# Altium schematic sheet Control circuit.SchDoc (part 4 of 4)
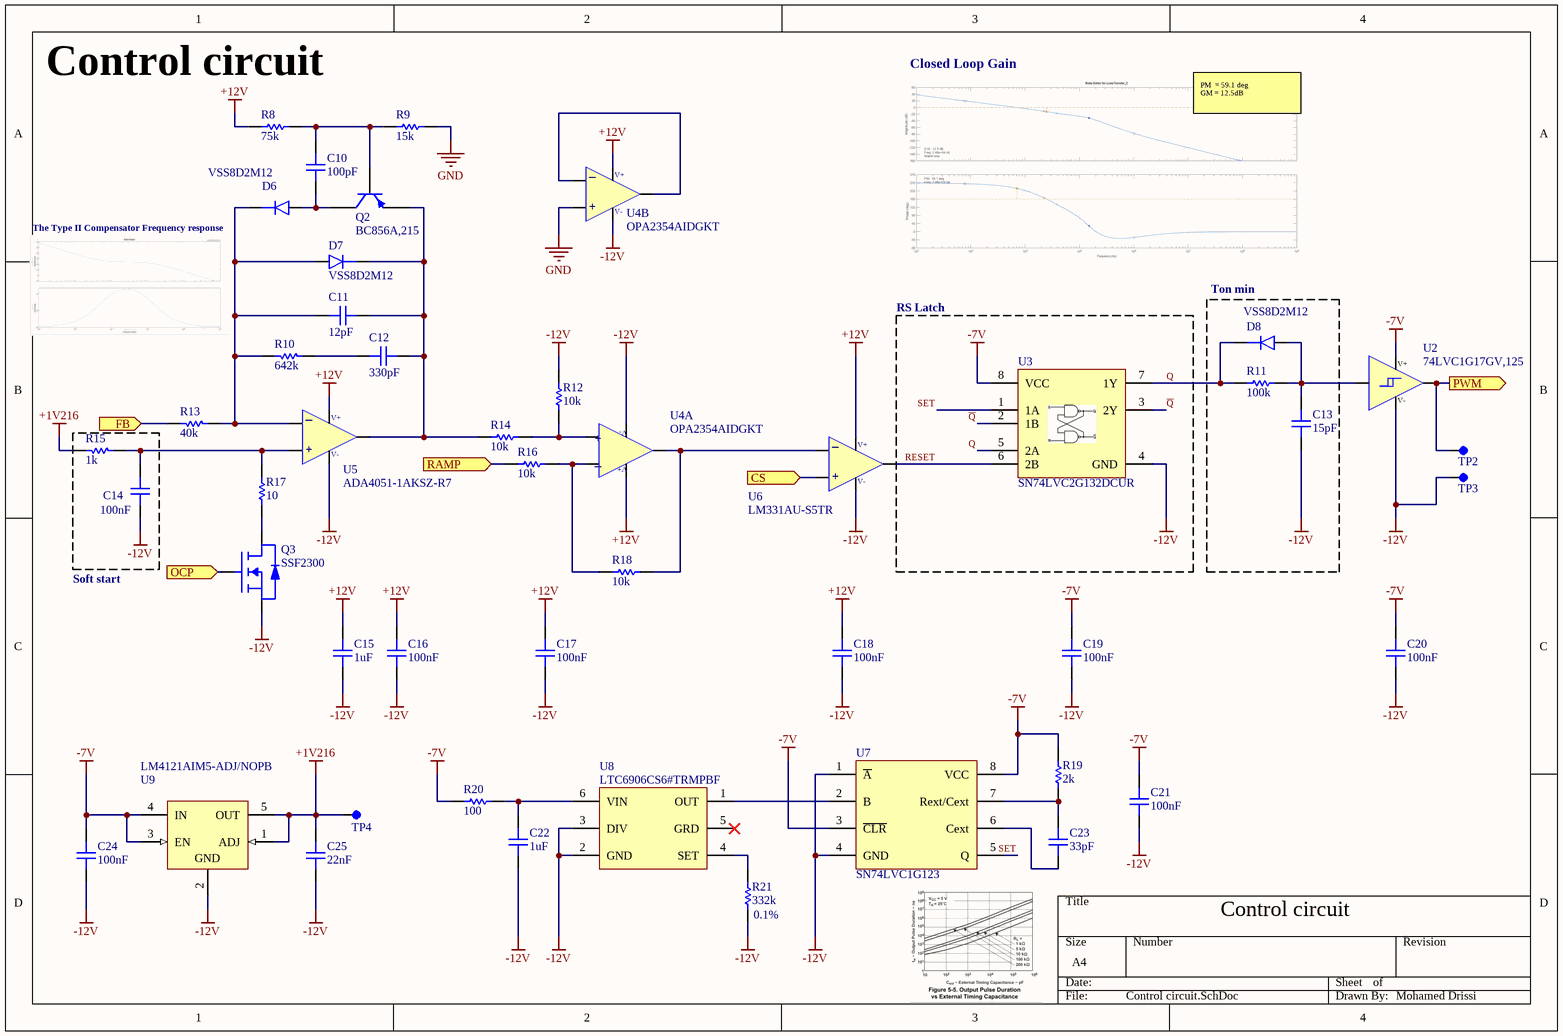
[diagram p3: Control circuit.SchDoc]

## Library data of the parts (continued)
U4 = TI OPA2354AIDGKT: 250MHz, Rail-to-Rail I/O, CMOS Dual Operational Amplifier 8-VSSOP -40 to 125; Manufacturer: Texas Instruments; Manufacturer Part Number: OPA2354AIDGKR; Manufacturer Lifecycle Status: ACTIVE; Bandwidth: 100MHz; Common Mode Rejection Ratio: 56dB; Input Bias Current: 50pA; Input Offset Voltage (Vos): 8mV; Max Dual Supply Voltage: 2.75V; Max Supply Voltage: 5.5V; Min Dual Supply Voltage: 1.25V; Min Supply Voltage: 2.7V; Number of Amplifiers: 2; Operating Supply Current: 4.9mA; Operating Supply Voltage: 5V; Output Current per Channel: 100mA; Power Supply Rejection Ratio (PSRR): 73.98dB; Settling Time: 30ns; Slew Rate: 150V/µs; Voltage Gain: 110dB; Supplier: Arrow Electronics; Supplier Part Number: OPA2354AIDGKR; RoHS: Compliant; Category: Amplifiers - Op Amps, Buffer, Instrumentation; Stock: 405; Pricing: 1=3,4072, 10=2,642, 25=2,4277, 100=2,1887, 250=2,1187 (USD); -3db Bandwidth: 250MHz; Case/Package: VSSOP; Contact Plating: Gold; Gain Bandwidth Product: 100MHz; Height: 0m; Lead Free: Lead Free; Length: 3mm; Lifecycle Status: Production; Max I/O Voltage: 8mV; Max Operating Temperature: 125°C; Min Operating Temperature: -40°C; Number of Channels: 2; Number of Circuits: 2; Number of Elements: 2; Pins: 8; Packaging: Tape & Reel; Radiation Hardening: No; REACH SVHC: No; Schedule B: 8542330000, 8542330000|8542330000|8542330000|8542330000|8542330000; Thickness: 970µm; Weight: 25.996513mg; Width: 3mm; ComponentLink1URL: https://sigma.octopart.com:443/178522223/technical_drawing/Texas-Instruments-OPA2354AIDGKR.pdf?src-supplier=Texas+Instruments; ComponentLink1Description: https://sigma.octopart.com:443/178522223/technical_drawing/Texas-Instruments-OPA2354AIDGKR.pdf?src-supplier=Texas+Instruments; ComponentLink2URL: https://octopart.com:443/opatz8j6/c1?t=Pa_9qveCSp-teMjALlNzkgIwHySsEH1otGT4-ozlPtpgDBMeQt4RGdCXYLn_JCFP1QmrjeruCX46t5_9x1Vv_HMTe8N2kMCMJSKESAMrUlSEQkUUlvcrYWij36RLFxFIZ71Lc0yaeicxHxnXPoQU53aq-yWmIh8tbbINPdenUxvDlVVEa9B7WHzU_yp1bt2IvVJEFKXj11ElcUGRh8J0UxRLcVoULThUuFLrJzUTYUNzb_hUsr_lfzCjSS3L8z7PJpNcHNUUaHBHycr75X7YKBAE5ea9dFt3yqiIqO4iZzm6zpO_8qWc6W5q5mEQ-4UQhYYz8poDoqX8BFz8V-vYXWSk_wmgHIOJwbmA8UY43GJhW0_LIaHlWEHxuqfohlnhpKt4&src-supplier=Texas+Instruments; ComponentLink2Description: https://octopart.com:443/opatz8j6/c1?t=Pa_9qveCSp-teMjALlNzkgIwHySsEH1otGT4-ozlPtpgDBMeQt4RGdCXYLn_JCFP1QmrjeruCX46t5_9x1Vv_HMTe8N2kMCMJSKESAMrUlSEQkUUlvcrYWij36RLFxFIZ71Lc0yaeicxHxnXPoQU53aq-yWmIh8tbbINPdenUxvDlVVEa9B7WHzU_yp1bt2IvVJEFKXj11ElcUGRh8J0UxRLcVoULThUuFLrJzUTYUNzb_hUsr_lfzCjSS3L8z7PJpNcHNUUaHBHycr75X7YKBAE5ea9dFt3yqiIqO4iZzm6zpO_8qWc6W5q5mEQ-4UQhYYz8poDoqX8BFz8V-vYXWSk_wmgHIOJwbmA8UY43GJhW0_LIaHlWEHxuqfohlnhpKt4&src-supplier=Texas+Instruments; ComponentLink3URL: https://datasheet.octopart.com:443/OPA2354AIDGKR-Texas-Instruments-datasheet-148930.pdf?src-supplier=Texas+Instruments; ComponentLink3Description: https://datasheet.octopart.com:443/OPA2354AIDGKR-Texas-Instruments-datasheet-148930.pdf?src-supplier=Texas+Instruments; ComponentLink4URL: https://sigma.octopart.com:443/49250154/technical_drawing/Texas-Instruments-OPA2354AIDGKR.pdf?src-supplier=Texas+Instruments; ComponentLink4Description: https://sigma.octopart.com:443/49250154/technical_drawing/Texas-Instruments-OPA2354AIDGKR.pdf?src-supplier=Texas+Instruments; ComponentLink5URL: https://datasheet.octopart.com:443/OPA2354AIDGKR-Texas-Instruments-datasheet-65713369.pdf?src-supplier=Farnell; ComponentLink5Description: https://datasheet.octopart.com:443/OPA2354AIDGKR-Texas-Instruments-datasheet-65713369.pdf?src-supplier=Farnell; ComponentLink6URL: https://datasheet.octopart.com:443/OPA2354AIDGKR-Texas-Instruments-datasheet-11534205.pdf?src-supplier=HQonline; ComponentLink6Description: https://datasheet.octopart.com:443/OPA2354AIDGKR-Texas-Instruments-datasheet-11534205.pdf?src-supplier=HQonline; ComponentLink7URL: https://datasheet.octopart.com:443/OPA2354AIDGKR-Texas-Instruments-datasheet-159115581.pdf?src-supplier=LCSC; ComponentLink7Description: https://datasheet.octopart.com:443/OPA2354AIDGKR-Texas-Instruments-datasheet-159115581.pdf?src-supplier=LCSC; ComponentLink8URL: https://datasheet.octopart.com:443/OPA2354AIDGKR.-Texas-Instruments-datasheet-33010601.pdf?src-supplier=element14+APAC; ComponentLink8Description: https://datasheet.octopart.com:443/OPA2354AIDGKR.-Texas-Instruments-datasheet-33010601.pdf?src-supplier=element14+APAC; ComponentLink9URL: https://datasheet.octopart.com:443/OPA2354AIDGKR-Texas-Instruments-datasheet-21221028.pdf?src-supplier=Newark; ComponentLink9Description: https://datasheet.octopart.com:443/OPA2354AIDGKR-Texas-Instruments-datasheet-21221028.pdf?src-supplier=Newark; ComponentLink10URL: https://datasheet.octopart.com:443/OPA2354AIDGKR-Texas-Instruments-datasheet-21222707.pdf?src-supplier=Newark; ComponentLink10Description: https://datasheet.octopart.com:443/OPA2354AIDGKR-Texas-Instruments-datasheet-21222707.pdf?src-supplier=Newark; ComponentLink11URL: https://datasheet.octopart.com:443/OPA2354AIDGKR-Texas-Instruments-datasheet-14137483.pdf?src-supplier=iiiC; ComponentLink11Description: https://datasheet.octopart.com:443/OPA2354AIDGKR-Texas-Instruments-datasheet-14137483.pdf?src-supplier=iiiC; ComponentLink12URL: https://datasheet.octopart.com:443/OPA2354AIDGKR-Texas-Instruments-datasheet-11629923.pdf?src-supplier=Arrow+Electronics; ComponentLink12Description: https://datasheet.octopart.com:443/OPA2354AIDGKR-Texas-Instruments-datasheet-11629923.pdf?src-supplier=Arrow+Electronics; ComponentLink13URL: https://datasheet.octopart.com:443/OPA2354AIDGKR-Texas-Instruments-datasheet-111724.pdf?src-supplier=Sierra+IC; ComponentLink13Description: https://datasheet.octopart.com:443/OPA2354AIDGKR-Texas-Instruments-datasheet-111724.pdf?src-supplier=Sierra+IC; ComponentLink14URL: https://datasheet.octopart.com:443/OPA2354AIDGKR-Texas-Instruments-datasheet-38628.pdf?src-supplier=DigiKey; ComponentLink14Description: https://datasheet.octopart.com:443/OPA2354AIDGKR-Texas-Instruments-datasheet-38628.pdf?src-supplier=DigiKey; ComponentLink15URL: http://sigma.octopart.com:80/reach_statement/Texas-Instruments-company-64.pdf?src-supplier=Compliance+Statements; ComponentLink15Description: http://sigma.octopart.com:80/reach_statement/Texas-Instruments-company-64.pdf?src-supplier=Compliance+Statements; ComponentLink16URL: http://sigma.octopart.com:80/conflict_mineral_statement/Texas-Instruments-company-63.pdf?src-supplier=Compliance+Statements; ComponentLink16Description: http://sigma.octopart.com:80/conflict_mineral_statement/Texas-Instruments-company-63.pdf?src-supplier=Compliance+Statements
U5 = Analog Device ADA4051-1AKSZ-R7: Op Amp Single Micropower Amplifier R-R I/O 5.5V 5-Pin SC-70 T/R; Manufacturer: Analog Devices; Manufacturer Lifecycle Status: PRODUCTION; Bandwidth: 125kHz; Common Mode Rejection Ratio: 135dB; Input Bias Current: 20pA; Input Capacitance: 5pF; Input Offset Voltage (Vos): 17µV; Min Supply Voltage: 1.8V; Number of Amplifiers: 1; Operating Supply Current: 15µA; Output Current per Channel: 15mA; Settling Time: 110µs; Slew Rate: 0.06V/µs; Supplier: Farnell; Supplier Part Number: ADA4051-1AKSZ-R7; Manufacturer Part Number: ADA4051-1AKSZ-R7; RoHS: Compliant; Category: Amplifiers - Op Amps, Buffer, Instrumentation; Stock: 2998; Pricing: 1=2,64, 10=1,99, 25=1,82, 100=1,64, 250=1,55, 500=1,51 (GBP); Case/Package: SC; Contact Plating: Gold; Gain Bandwidth Product: 125kHz; Lead Free: Contains Lead; Lifecycle Status: Production; Max Operating Temperature: 125°C; Max Supply Voltage: 5.5V; Min Operating Temperature: -40°C; Number of Channels: 1; Number of Circuits: 1; Number of Elements: 1; Pins: 5; Power Supply Rejection Ratio (PSRR): 135dB; Quiescent Current: 15µA; Radiation Hardening: No; REACH SVHC: No; Schedule B: 8542330000, 8542330000|8542330000|8542330000|8542330000|8542330000; Voltage Gain: 135dB; ComponentLink1URL: https://datasheet.octopart.com:443/ADA4051-1AKSZ-R7-Analog-Devices-datasheet-8791794.pdf?src-supplier=Upverter; ComponentLink1Description: https://datasheet.octopart.com:443/ADA4051-1AKSZ-R7-Analog-Devices-datasheet-8791794.pdf?src-supplier=Upverter; ComponentLink2URL: https://octopart.com:443/opatz8j6/c1?t=rJJSgKe-ixBsgHruP_dMyvdcYWh8VxYktSnzxyfwgHDbKLKC92zca7cigscwZEaM0lo2HiNT3MH3wQ-2LX-M9Az7IcjdZjIeVxf5AT0hvHfOIPgFhdUnJF0J1I10w6WCzRwC901KpDeY74zyeRPGvO5LAbMw0CobDR2CsodOcFkNt9MQH1-RFuewA9IsU1jv6IjapC8nD5KlUayfNQf8mV_EJh40J36P7WJ_ySqdKCrG-lzOgQPC2h9lNvby1AUvUdXqNeCc0od4Gope5gYX_VswtoiygC4NIFcVhX65H1SStPGZ_82TzO4o&src-supplier=Analog+Devices; ComponentLink2Description: https://octopart.com:443/opatz8j6/c1?t=rJJSgKe-ixBsgHruP_dMyvdcYWh8VxYktSnzxyfwgHDbKLKC92zca7cigscwZEaM0lo2HiNT3MH3wQ-2LX-M9Az7IcjdZjIeVxf5AT0hvHfOIPgFhdUnJF0J1I10w6WCzRwC901KpDeY74zyeRPGvO5LAbMw0CobDR2CsodOcFkNt9MQH1-RFuewA9IsU1jv6IjapC8nD5KlUayfNQf8mV_EJh40J36P7WJ_ySqdKCrG-lzOgQPC2h9lNvby1AUvUdXqNeCc0od4Gope5gYX_VswtoiygC4NIFcVhX65H1SStPGZ_82TzO4o&src-supplier=Analog+Devices; ComponentLink3URL: https://datasheet.octopart.com:443/ADA4051-1AKSZ-R7-Analog-Devices-datasheet-10548184.pdf?src-supplier=Analog+Devices; ComponentLink3Description: https://datasheet.octopart.com:443/ADA4051-1AKSZ-R7-Analog-Devices-datasheet-10548184.pdf?src-supplier=Analog+Devices; ComponentLink4URL: https://datasheet.octopart.com:443/ADA4051-1AKSZ-R7-Analog-Devices-datasheet-62284931.pdf?src-supplier=Augswan; ComponentLink4Description: https://datasheet.octopart.com:443/ADA4051-1AKSZ-R7-Analog-Devices-datasheet-62284931.pdf?src-supplier=Augswan; ComponentLink5URL: https://datasheet.octopart.com:443/ADA4051-1AKSZ-R7-Analog-Devices-datasheet-165826941.pdf?src-supplier=element14+APAC; ComponentLink5Description: https://datasheet.octopart.com:443/ADA4051-1AKSZ-R7-Analog-Devices-datasheet-165826941.pdf?src-supplier=element14+APAC; ComponentLink6URL: http://sigma.octopart.com:80/conflict_mineral_statement/Analog-Devices-company-33.pdf?src-supplier=Compliance+Statements; ComponentLink6Description: http://sigma.octopart.com:80/conflict_mineral_statement/Analog-Devices-company-33.pdf?src-supplier=Compliance+Statements; ComponentLink7URL: https://octopart.com:443/opatz8j6/c1?t=0GX_hfKgSMIsbNrE8b34QJAb0CCNZ6_ezWHTaaiZJR_aWRrHXcXZK1igBECXO0xCZYVK5GrASg4C3zYQqAJSviM5nON9Ij1twWqpeXzFcwgJ4LC7jixMVPYygbP3XV2mr0ayiR9F56Bbj5JLA-7nmjt3c8viBDnSCKzac_WhTH3deLBC3ZmpMauG607RU4KYk36P2kmz-5XzFW-Eu3BtbhjKoDF2JZMeJ3TmcpbQkdN-83rE9pioA5eI-Um-4VwgjZtxOMdpSRa48wH-6RAMWxbPWrNxxsdm-7adIByWP0Rbww03xyshOf5b&src-supplier=Compliance+Statements; ComponentLink7Description: https://octopart.com:443/opatz8j6/c1?t=0GX_hfKgSMIsbNrE8b34QJAb0CCNZ6_ezWHTaaiZJR_aWRrHXcXZK1igBECXO0xCZYVK5GrASg4C3zYQqAJSviM5nON9Ij1twWqpeXzFcwgJ4LC7jixMVPYygbP3XV2mr0ayiR9F56Bbj5JLA-7nmjt3c8viBDnSCKzac_WhTH3deLBC3ZmpMauG607RU4KYk36P2kmz-5XzFW-Eu3BtbhjKoDF2JZMeJ3TmcpbQkdN-83rE9pioA5eI-Um-4VwgjZtxOMdpSRa48wH-6RAMWxbPWrNxxsdm-7adIByWP0Rbww03xyshOf5b&src-supplier=Compliance+Statements
U6 = 3Peak LM331AU-S5TR: 150¦ÌA 500ns Open Collector, Rail to Rail 20mA 1 2.5V ¡À18V, 36V 6mV@ 5V 4nA@ 5V SOT-23-5 , 2.9mm; Manufacturer: 3Peak; Input Bias Current: 1nA; Input Offset Voltage (Vos): 6mV; Max Supply Current: 300µA; Max Supply Voltage: 42V; Number of Circuits: 1; Response Time: 2µs; Supplier: DigiKey; Supplier Part Number: 5503-LM331AU-S5TRCT-ND; Manufacturer Part Number: LM331AU-S5TR; RoHS: Compliant; Category: Amplifiers - Op Amps, Buffer, Instrumentation; Stock: 2199; Pricing: 1=0,1, 10=0,069, 25=0,06, 100=0,0505, 250=0,04588, 500=0,0431, 1000=0,04081 (USD); Case/Package: LSSOP; Export Control Classification Number (ECCN) Code: EAR99; Height - Seated (Max): 1.25mm; Harmonized Tariff Schedule (HTS) Code: 8542.39.00.60; Length: 2.92mm; Max Operating Temperature: 125°C; Min Operating Temperature: -40°C; Number of Terminals: 5; Operating Supply Voltage: 5V; REACH SVHC: Yes; Terminal Pitch: 950µm; Width: 1.61mm; ComponentLink1URL: https://datasheet.octopart.com:443/LM331AU-S5TR-3Peak-datasheet-182190405.pdf?src-supplier=IHS; ComponentLink1Description: https://datasheet.octopart.com:443/LM331AU-S5TR-3Peak-datasheet-182190405.pdf?src-supplier=IHS
U7 = TI SN74LVC1G123DCUR: Single retriggerable monostable multivibrator with Schmitt-trigger inputs 8-VSSOP -40 to 125; Manufacturer: Texas Instruments; Manufacturer Lifecycle Status: ACTIVE; High Level Output Current: -32mA; Independent Circuits: 1; Low Level Output Current: 32mA; Max Supply Current: 20µA; Max Supply Voltage: 5.5V; Min Supply Voltage: 1.5V; Number of Inputs: 2; Operating Supply Voltage: 5V; Output Current: 50mA; Propagation Delay: 8.2ns; Schmitt Trigger Input: Yes; Turn-On Delay Time: 18.6ns; Supplier: DigiKey; Supplier Part Number: 296-18578-1-ND; Manufacturer Part Number: SN74LVC1G123DCUR; RoHS: Compliant; Category: Multivibrators; Pricing: 1=1,35, 10=0,979, 25=0,8868, 100=0,7857, 250=0,73748, 500=0,7191 (USD); Ambient Temperature Range High: 125°C; Case/Package: VSSOP; Contact Plating: Gold; Height: 900µm; Lead Free: Lead Free; Length: 2.3mm; Lifecycle Status: Production; Logic Function: Multivibrator; Max Operating Temperature: 125°C; Min Operating Temperature: -40°C; Mounting Technology: Surface Mount; Number of Bits: 1; Number of Channels: 1; Number of Circuits: 1; Number of Elements: 1; Number of Outputs: 1; Pins: 8; Packaging: Cut Tape; Quiescent Current: 20µA; Radiation Hardening: No; REACH SVHC: No; Schedule B: 8542390000, 8542390000|8542390000|8542390000|8542390000|8542390000|8542390000|8542390000|8542390000|8542390000|8542390000|8542390000|8542390000|8542390000|8542390000|8542390000|8542390000|8542390000|8542390000|8542390000|8542390000|8542390000|8542390000|8542390000|85; Thickness: 850µm; Weight: 9.610488mg; Width: 2mm; ComponentLink1URL: https://sigma.octopart.com:443/167215082/technical_drawing/Texas-Instruments-SN74LVC1G123DCUR.pdf?src-supplier=Texas+Instruments; ComponentLink1Description: https://sigma.octopart.com:443/167215082/technical_drawing/Texas-Instruments-SN74LVC1G123DCUR.pdf?src-supplier=Texas+Instruments; ComponentLink2URL: https://octopart.com:443/opatz8j6/c1?t=n_fj5RPNHgWJn-fIAghX4cny0sbFoMMjoesAMqocVMpXaQDqpBsjBT1GJKZBsxw_STcCp5G4kwnKmlBTyHV3O9PyOTB6O-nccl63CCh-Jzq2YYcs5B_OdZggVhRk2N_tuhYi8ZNUi7kwNjyKB0fMgoynCN9uNWe1hvWVLEQ6W185Sz4YeGwVA567UY9FzGdURNODUKoe1l6S4pdebDOplCzjyZH4KwSx6kPuk87sJlWbiIVW1AN5VQlF6jdha2zYaH4bePnb42lLDbuYH42-v4M-5hsJe31Qnxu0c94xEXvz2RKb29Iju4-DhIHoIrvsF3f5Cfn0tP11-Py_jycrA_EZkptVG4siqhKe7FjYdmgEw4Uf1H2m47JZ605DKYGK_CBTGz3HQw&src-supplier=Texas+Instruments; ComponentLink2Description: https://octopart.com:443/opatz8j6/c1?t=n_fj5RPNHgWJn-fIAghX4cny0sbFoMMjoesAMqocVMpXaQDqpBsjBT1GJKZBsxw_STcCp5G4kwnKmlBTyHV3O9PyOTB6O-nccl63CCh-Jzq2YYcs5B_OdZggVhRk2N_tuhYi8ZNUi7kwNjyKB0fMgoynCN9uNWe1hvWVLEQ6W185Sz4YeGwVA567UY9FzGdURNODUKoe1l6S4pdebDOplCzjyZH4KwSx6kPuk87sJlWbiIVW1AN5VQlF6jdha2zYaH4bePnb42lLDbuYH42-v4M-5hsJe31Qnxu0c94xEXvz2RKb29Iju4-DhIHoIrvsF3f5Cfn0tP11-Py_jycrA_EZkptVG4siqhKe7FjYdmgEw4Uf1H2m47JZ605DKYGK_CBTGz3HQw&src-supplier=Texas+Instruments; ComponentLink3URL: https://datasheet.octopart.com:443/SN74LVC1G123DCUR-Texas-Instruments-datasheet-10255335.pdf?src-supplier=Texas+Instruments; ComponentLink3Description: https://datasheet.octopart.com:443/SN74LVC1G123DCUR-Texas-Instruments-datasheet-10255335.pdf?src-supplier=Texas+Instruments; ComponentLink4URL: https://datasheet.octopart.com:443/SN74LVC1G123DCUR-Texas-Instruments-datasheet-149469.pdf?src-supplier=Texas+Instruments; ComponentLink4Description: https://datasheet.octopart.com:443/SN74LVC1G123DCUR-Texas-Instruments-datasheet-149469.pdf?src-supplier=Texas+Instruments; ComponentLink5URL: https://sigma.octopart.com:443/49249948/technical_drawing/Texas-Instruments-SN74LVC1G123DCUR.pdf?src-supplier=Texas+Instruments; ComponentLink5Description: https://sigma.octopart.com:443/49249948/technical_drawing/Texas-Instruments-SN74LVC1G123DCUR.pdf?src-supplier=Texas+Instruments; ComponentLink6URL: https://datasheet.octopart.com:443/SN74LVC1G123DCUR-Texas-Instruments-datasheet-21094337.pdf?src-supplier=Farnell; ComponentLink6Description: https://datasheet.octopart.com:443/SN74LVC1G123DCUR-Texas-Instruments-datasheet-21094337.pdf?src-supplier=Farnell; ComponentLink7URL: https://datasheet.octopart.com:443/SN74LVC1G123DCUR.-Texas-Instruments-datasheet-37730660.pdf?src-supplier=Farnell; ComponentLink7Description: https://datasheet.octopart.com:443/SN74LVC1G123DCUR.-Texas-Instruments-datasheet-37730660.pdf?src-supplier=Farnell; ComponentLink8URL: https://datasheet.octopart.com:443/SN74LVC1G123DCUR-Texas-Instruments-datasheet-32026718.pdf?src-supplier=Farnell; ComponentLink8Description: https://datasheet.octopart.com:443/SN74LVC1G123DCUR-Texas-Instruments-datasheet-32026718.pdf?src-supplier=Farnell; ComponentLink9URL: https://datasheet.octopart.com:443/SN74LVC1G123DCUR-Texas-Instruments-datasheet-17022321.pdf?src-supplier=Upverter; ComponentLink9Description: https://datasheet.octopart.com:443/SN74LVC1G123DCUR-Texas-Instruments-datasheet-17022321.pdf?src-supplier=Upverter; ComponentLink10URL: https://datasheet.octopart.com:443/SN74LVC1G123DCUR-Texas-Instruments-datasheet-62115999.pdf?src-supplier=element14+APAC; ComponentLink10Description: https://datasheet.octopart.com:443/SN74LVC1G123DCUR-Texas-Instruments-datasheet-62115999.pdf?src-supplier=element14+APAC; ComponentLink11URL: https://datasheet.octopart.com:443/SN74LVC1G123DCUR-Texas-Instruments-datasheet-33011000.pdf?src-supplier=element14+APAC; ComponentLink11Description: https://datasheet.octopart.com:443/SN74LVC1G123DCUR-Texas-Instruments-datasheet-33011000.pdf?src-supplier=element14+APAC; ComponentLink12URL: https://datasheet.octopart.com:443/SN74LVC1G123DCUR-Texas-Instruments-datasheet-10854746.pdf?src-supplier=Newark; ComponentLink12Description: https://datasheet.octopart.com:443/SN74LVC1G123DCUR-Texas-Instruments-datasheet-10854746.pdf?src-supplier=Newark; ComponentLink13URL: https://datasheet.octopart.com:443/SN74LVC1G123DCUR-Texas-Instruments-datasheet-7621638.pdf?src-supplier=Newark; ComponentLink13Description: https://datasheet.octopart.com:443/SN74LVC1G123DCUR-Texas-Instruments-datasheet-7621638.pdf?src-supplier=Newark; ComponentLink14URL: https://datasheet.octopart.com:443/SN74LVC1G123DCUR-Texas-Instruments-datasheet-5394187.pdf?src-supplier=Newark; ComponentLink14Description: https://datasheet.octopart.com:443/SN74LVC1G123DCUR-Texas-Instruments-datasheet-5394187.pdf?src-supplier=Newark; ComponentLink15URL: https://datasheet.octopart.com:443/SN74LVC1G123DCUR-Texas-Instruments-datasheet-159116636.pdf?src-supplier=LCSC; ComponentLink15Description: https://datasheet.octopart.com:443/SN74LVC1G123DCUR-Texas-Instruments-datasheet-159116636.pdf?src-supplier=LCSC; ComponentLink16URL: https://datasheet.octopart.com:443/SN74LVC1G123DCUR-Texas-Instruments-datasheet-151190429.pdf?src-supplier=SHENGYU+ELECTRONICS; ComponentLink16Description: https://datasheet.octopart.com:443/SN74LVC1G123DCUR-Texas-Instruments-datasheet-151190429.pdf?src-supplier=SHENGYU+ELECTRONICS; ComponentLink17URL: https://datasheet.octopart.com:443/SN74LVC1G123DCUR-Texas-Instruments-datasheet-8197537.pdf?src-supplier=Jameco; ComponentLink17Description: https://datasheet.octopart.com:443/SN74LVC1G123DCUR-Texas-Instruments-datasheet-8197537.pdf?src-supplier=Jameco; ComponentLink18URL: https://datasheet.octopart.com:443/SN74LVC1G123DCUR-Texas-Instruments-datasheet-33954.pdf?src-supplier=DigiKey; ComponentLink18Description: https://datasheet.octopart.com:443/SN74LVC1G123DCUR-Texas-Instruments-datasheet-33954.pdf?src-supplier=DigiKey; ComponentLink19URL: https://datasheet.octopart.com:443/SN74LVC1G123DCUR-Texas-Instruments-datasheet-116326.pdf?src-supplier=Sierra+IC; ComponentLink19Description: https://datasheet.octopart.com:443/SN74LVC1G123DCUR-Texas-Instruments-datasheet-116326.pdf?src-supplier=Sierra+IC; ComponentLink20URL: http://sigma.octopart.com:80/reach_statement/Texas-Instruments-company-64.pdf?src-supplier=Compliance+Statements; ComponentLink20Description: http://sigma.octopart.com:80/reach_statement/Texas-Instruments-company-64.pdf?src-supplier=Compliance+Statements; ComponentLink21URL: http://sigma.octopart.com:80/conflict_mineral_statement/Texas-Instruments-company-63.pdf?src-supplier=Compliance+Statements; ComponentLink21Description: http://sigma.octopart.com:80/conflict_mineral_statement/Texas-Instruments-company-63.pdf?src-supplier=Compliance+Statements
U8 = LT LTC6906CS6#TRMPBF: Silicon Oscillator 0.01MHz to 1MHz CMOS Automotive 6-Pin TSOT-23 Tape and Reel; Manufacturer: Analog Devices; Manufacturer Lifecycle Status: PRODUCTION; Frequency Stability: 300ppm; Frequency Tolerance: 2.2%; Max Supply Voltage: 5.5V; Min Supply Voltage: 2.25V; Operating Supply Current: 78µA; Supplier: Farnell; Supplier Part Number: LTC6906CS6#TRMPBF; Manufacturer Part Number: LTC6906CS6#TRMPBF; RoHS: Compliant; Category: Oscillators; Stock: 356; Pricing: 1=3,36, 10=2,78, 25=2,56, 100=2,32, 250=2,21, 500=2,13 (GBP); Case/Package: TSOT; Depth: 1.75mm; Frequency: 1MHz; Height: 900µm; Lead Free: Lead Free; Length: 2.9mm; Lifecycle Status: Production; Max Operating Temperature: 70°C; Min Operating Temperature: 0°C; Mounting Technology: Surface Mount; Pins: 6; Packaging: Cut Tape; Radiation Hardening: No; REACH SVHC: No; Schedule B: 8542390000, 8542390000|8542390000, 8542390000|8542390000|8542390000, 8542390000|8542390000|8542390000|8542390000; Termination: SMD/SMT; Width: 1.5mm; ComponentLink1URL: https://octopart.com:443/opatz8j6/c1?t=5shEcAoDsy_XxBf8-3cQVwQ-JvjDtMMTIk6rGVaBNgmvbeSoX7vtHjRf0MJrdEAFbgpJTSVEO870sKztRY-aBtnamZdVHG-oMueyTG1OlPZtxRJw4_FPB7Xvszx5gmi7j8LkgxkWjBXGie93SmNZGKdNBD_RwhpypTiyzJIBXT4xQs2d2-W7384-WSsaE-WzT5hUJcMPsf97nd3Il2B6xOlBl4DdmV-mm7fCR3Uv3xQ2oKLk-iwNWKrEg-nSez1F6NtQ2_yz7Ixqw3X5WDviEApaeU2x0KBfkGZ6NuNmvPVQun559A8TaUg&src-supplier=Analog+Devices; ComponentLink1Description: https://octopart.com:443/opatz8j6/c1?t=5shEcAoDsy_XxBf8-3cQVwQ-JvjDtMMTIk6rGVaBNgmvbeSoX7vtHjRf0MJrdEAFbgpJTSVEO870sKztRY-aBtnamZdVHG-oMueyTG1OlPZtxRJw4_FPB7Xvszx5gmi7j8LkgxkWjBXGie93SmNZGKdNBD_RwhpypTiyzJIBXT4xQs2d2-W7384-WSsaE-WzT5hUJcMPsf97nd3Il2B6xOlBl4DdmV-mm7fCR3Uv3xQ2oKLk-iwNWKrEg-nSez1F6NtQ2_yz7Ixqw3X5WDviEApaeU2x0KBfkGZ6NuNmvPVQun559A8TaUg&src-supplier=Analog+Devices; ComponentLink2URL: https://datasheet.octopart.com:443/LTC6906CS6%23TRMPBF-Analog-Devices-datasheet-16887856.pdf?src-supplier=Farnell; ComponentLink2Description: https://datasheet.octopart.com:443/LTC6906CS6%23TRMPBF-Analog-Devices-datasheet-16887856.pdf?src-supplier=Farnell; ComponentLink3URL: https://datasheet.octopart.com:443/LTC6906CS6%23TRMPBF-Linear-Technology-datasheet-620052.pdf?src-supplier=Farnell; ComponentLink3Description: https://datasheet.octopart.com:443/LTC6906CS6%23TRMPBF-Linear-Technology-datasheet-620052.pdf?src-supplier=Farnell; ComponentLink4URL: https://datasheet.octopart.com:443/LTC6906CS6%23TRMPBF-Linear-Technology-datasheet-10379881.pdf?src-supplier=Farnell; ComponentLink4Description: https://datasheet.octopart.com:443/LTC6906CS6%23TRMPBF-Linear-Technology-datasheet-10379881.pdf?src-supplier=Farnell; ComponentLink5URL: https://datasheet.octopart.com:443/LTC6906CS6%23TRMPBF-Analog-Devices-datasheet-155467709.pdf?src-supplier=element14+APAC; ComponentLink5Description: https://datasheet.octopart.com:443/LTC6906CS6%23TRMPBF-Analog-Devices-datasheet-155467709.pdf?src-supplier=element14+APAC; ComponentLink6URL: https://datasheet.octopart.com:443/LTC6906CS6%23TRMPBF-Linear-Technology-datasheet-11553417.pdf?src-supplier=Arrow+Electronics; ComponentLink6Description: https://datasheet.octopart.com:443/LTC6906CS6%23TRMPBF-Linear-Technology-datasheet-11553417.pdf?src-supplier=Arrow+Electronics; ComponentLink7URL: https://sigma.octopart.com:443/57691988/technical_drawing/Linear-Technology-LTC6906CS6%23TRMPBF.pdf?src-supplier=Linear+Technology; ComponentLink7Description: https://sigma.octopart.com:443/57691988/technical_drawing/Linear-Technology-LTC6906CS6%23TRMPBF.pdf?src-supplier=Linear+Technology; ComponentLink8URL: https://datasheet.octopart.com:443/LTC6906CS6%23TRMPBF-Linear-Technology-datasheet-8734172.pdf?src-supplier=Component+Distributors+Inc.; ComponentLink8Description: https://datasheet.octopart.com:443/LTC6906CS6%23TRMPBF-Linear-Technology-datasheet-8734172.pdf?src-supplier=Component+Distributors+Inc.; ComponentLink9URL: http://sigma.octopart.com:80/conflict_mineral_statement/Analog-Devices-company-33.pdf?src-supplier=Compliance+Statements; ComponentLink9Description: http://sigma.octopart.com:80/conflict_mineral_statement/Analog-Devices-company-33.pdf?src-supplier=Compliance+Statements; ComponentLink10URL: https://octopart.com:443/opatz8j6/c1?t=kH0laXzR-06GbpmgJwOnzW28bDfXahOBYcaV_c1Lxe4y35M1T6GdY0RRdgzHUUas5jleU_Lwsek7-Ov8LHbaQinlI1EkgssJSHM6R79JGr9wdbFlNNYzoX29OegbNfK5YlC5rZp3-IMbMt3ApRLFnqDC_E84-LL2A2By7NY3_RhmFsD-Hd4sM_WMaV7tybSM1xpGNiKAg43RGBp5GXKsG7yNikfwo8iRn1uHUWh5hOpfyrKb8bBnpxGuQL_X5lSy3IkotLSLGoqgJBkSU5KDscC7W5W4knJZLnG3qlhbeV0IwIKm5A5ppAM&src-supplier=Compliance+Statements; ComponentLink10Description: https://octopart.com:443/opatz8j6/c1?t=kH0laXzR-06GbpmgJwOnzW28bDfXahOBYcaV_c1Lxe4y35M1T6GdY0RRdgzHUUas5jleU_Lwsek7-Ov8LHbaQinlI1EkgssJSHM6R79JGr9wdbFlNNYzoX29OegbNfK5YlC5rZp3-IMbMt3ApRLFnqDC_E84-LL2A2By7NY3_RhmFsD-Hd4sM_WMaV7tybSM1xpGNiKAg43RGBp5GXKsG7yNikfwo8iRn1uHUWh5hOpfyrKb8bBnpxGuQL_X5lSy3IkotLSLGoqgJBkSU5KDscC7W5W4knJZLnG3qlhbeV0IwIKm5A5ppAM&src-supplier=Compliance+Statements
U9 = TI LM4121AIM5-ADJ/NOPB: V-Ref Adjustable 1.214V to 1.218V 5mA 5-Pin SOT-23 T/R; Manufacturer: Texas Instruments; Manufacturer Lifecycle Status: ACTIVE; Dropout Voltage: 250mV; Max Supply Voltage: 14V; Max Power Dissipation: 350mW; Min Input Voltage: 1.8V; Nominal Supply Current: 160µA; Number of Channels: 1; Quiescent Current: 275µA; Reference Type: Adjustable, Series; Reference Voltage: 1.216V; Temperature Coefficient: 50ppm/°C; Tolerance: 0.2%; Supplier: DigiKey; Supplier Part Number: LM4121AIM5-ADJ/NOPBCT-ND; Manufacturer Part Number: LM4121AIM5-ADJ/NOPB; RoHS: Compliant; Category: Voltage References; Stock: 5328; Pricing: 1=3,77, 10=2,841, 25=2,6084, 100=2,3532, 250=2,23148, 500=2,21238 (USD); Case/Package: SOT-23; Height: 1.45mm; Length: 2.9mm; Lifecycle Status: Production; Max Operating Temperature: 85°C; Max Output current: 5mA; Max Output Voltage: 1.218V; Min Operating Temperature: -40°C; Min Output Voltage: 1.214V; Mounting Technology: Surface Mount; Pins: 5; Output Current: 5mA; Output Voltage: 1.218V; Packaging: Cut Tape; Radiation Hardening: No; REACH SVHC: No; Schedule B: 8542390000; Termination: SMD/SMT; Thickness: 1.2mm; Width: 1.6mm; ComponentLink1URL: https://sigma.octopart.com:443/177332311/technical_drawing/Texas-Instruments-LM4121AIM5-ADJ-NOPB.pdf?src-supplier=Texas+Instruments; ComponentLink1Description: https://sigma.octopart.com:443/177332311/technical_drawing/Texas-Instruments-LM4121AIM5-ADJ-NOPB.pdf?src-supplier=Texas+Instruments; ComponentLink2URL: https://octopart.com:443/opatz8j6/c1?t=Uqlvhw3r5UNVskgnFtPwbjGJjJlK3X1B1fSbI2QEnI-Np4OkcA76HJ3IuJWKhKHtlQ-3erMHexCWtvY8K7sxcXbMJzxGcNf4-0lbMrHNPNKcSVcf_HRDu_BgKirhdY5pR037YaS4xAp4W468OawEFMNydzYVYSpPXP_Azdaj40jXJAWlvghlxuApHv7n7KwlgdMCfLDHoIBUa_S80HxuD919IwpoO42cD3TF7PpdkAVR8KdunTbgTyJZZrfg6JGyV4fcnKnVlcMlFQCxYdfv5NmroBnmfAYBG7LCJcCUqSuFnahvYVbcehvvT1xAzw6Eu2VpO2ERRggFY7KBQT638zJQavwchc799vrItG-b0ZJRVVqR7xvboE-Mkmx4Y-UFvvLhqA&src-supplier=Texas+Instruments; ComponentLink2Description: https://octopart.com:443/opatz8j6/c1?t=Uqlvhw3r5UNVskgnFtPwbjGJjJlK3X1B1fSbI2QEnI-Np4OkcA76HJ3IuJWKhKHtlQ-3erMHexCWtvY8K7sxcXbMJzxGcNf4-0lbMrHNPNKcSVcf_HRDu_BgKirhdY5pR037YaS4xAp4W468OawEFMNydzYVYSpPXP_Azdaj40jXJAWlvghlxuApHv7n7KwlgdMCfLDHoIBUa_S80HxuD919IwpoO42cD3TF7PpdkAVR8KdunTbgTyJZZrfg6JGyV4fcnKnVlcMlFQCxYdfv5NmroBnmfAYBG7LCJcCUqSuFnahvYVbcehvvT1xAzw6Eu2VpO2ERRggFY7KBQT638zJQavwchc799vrItG-b0ZJRVVqR7xvboE-Mkmx4Y-UFvvLhqA&src-supplier=Texas+Instruments; ComponentLink3URL: https://sigma.octopart.com:443/175570406/technical_drawing/Texas-Instruments-LM4121AIM5-ADJ-NOPB.pdf?src-supplier=Texas+Instruments; ComponentLink3Description: https://sigma.octopart.com:443/175570406/technical_drawing/Texas-Instruments-LM4121AIM5-ADJ-NOPB.pdf?src-supplier=Texas+Instruments; ComponentLink4URL: https://sigma.octopart.com:443/169406034/technical_drawing/Texas-Instruments-LM4121AIM5-ADJ-NOPB.pdf?src-supplier=Texas+Instruments; ComponentLink4Description: https://sigma.octopart.com:443/169406034/technical_drawing/Texas-Instruments-LM4121AIM5-ADJ-NOPB.pdf?src-supplier=Texas+Instruments; ComponentLink5URL: https://sigma.octopart.com:443/155939316/technical_drawing/Texas-Instruments-LM4121AIM5-ADJ-NOPB.pdf?src-supplier=Texas+Instruments; ComponentLink5Description: https://sigma.octopart.com:443/155939316/technical_drawing/Texas-Instruments-LM4121AIM5-ADJ-NOPB.pdf?src-supplier=Texas+Instruments; ComponentLink6URL: https://sigma.octopart.com:443/102331370/technical_drawing/Texas-Instruments-LM4121AIM5-ADJ-NOPB.pdf?src-supplier=Texas+Instruments; ComponentLink6Description: https://sigma.octopart.com:443/102331370/technical_drawing/Texas-Instruments-LM4121AIM5-ADJ-NOPB.pdf?src-supplier=Texas+Instruments; ComponentLink7URL: https://sigma.octopart.com:443/49249325/technical_drawing/Texas-Instruments-LM4121AIM5-ADJ-NOPB.pdf?src-supplier=Texas+Instruments; ComponentLink7Description: https://sigma.octopart.com:443/49249325/technical_drawing/Texas-Instruments-LM4121AIM5-ADJ-NOPB.pdf?src-supplier=Texas+Instruments; ComponentLink8URL: https://datasheet.octopart.com:443/LM4121AIM5-ADJ-NOPB-Texas-Instruments-datasheet-14775671.pdf?src-supplier=Texas+Instruments; ComponentLink8Description: https://datasheet.octopart.com:443/LM4121AIM5-ADJ-NOPB-Texas-Instruments-datasheet-14775671.pdf?src-supplier=Texas+Instruments; ComponentLink9URL: https://datasheet.octopart.com:443/LM4121AIM5-ADJ/NOPB-Texas-Instruments-datasheet-10844271.pdf?src-supplier=Texas+Instruments; ComponentLink9Description: https://datasheet.octopart.com:443/LM4121AIM5-ADJ/NOPB-Texas-Instruments-datasheet-10844271.pdf?src-supplier=Texas+Instruments; ComponentLink10URL: https://datasheet.octopart.com:443/LM4121AIM5-ADJ-NOPB-Texas-Instruments-datasheet-38190892.pdf?src-supplier=Newark; ComponentLink10Description: https://datasheet.octopart.com:443/LM4121AIM5-ADJ-NOPB-Texas-Instruments-datasheet-38190892.pdf?src-supplier=Newark; ComponentLink11URL: https://datasheet.octopart.com:443/LM4121AIM5-ADJ-NOPB-Texas-Instruments-datasheet-21415343.pdf?src-supplier=Newark; ComponentLink11Description: https://datasheet.octopart.com:443/LM4121AIM5-ADJ-NOPB-Texas-Instruments-datasheet-21415343.pdf?src-supplier=Newark; ComponentLink12URL: https://datasheet.octopart.com:443/LM4121AIM5-ADJ-NOPB-Texas-Instruments-datasheet-192323770.pdf?src-supplier=HQonline; ComponentLink12Description: https://datasheet.octopart.com:443/LM4121AIM5-ADJ-NOPB-Texas-Instruments-datasheet-192323770.pdf?src-supplier=HQonline; ComponentLink13URL: https://datasheet.octopart.com:443/LM4121AIM5-ADJ-NOPB-Texas-Instruments-datasheet-10782.pdf?src-supplier=Arrow+Electronics; ComponentLink13Description: https://datasheet.octopart.com:443/LM4121AIM5-ADJ-NOPB-Texas-Instruments-datasheet-10782.pdf?src-supplier=Arrow+Electronics; ComponentLink14URL: https://datasheet.octopart.com:443/LM4121AIM5-ADJ-NOPB-Texas-Instruments-datasheet-32985724.pdf?src-supplier=Farnell; ComponentLink14Description: https://datasheet.octopart.com:443/LM4121AIM5-ADJ-NOPB-Texas-Instruments-datasheet-32985724.pdf?src-supplier=Farnell; ComponentLink15URL: https://datasheet.octopart.com:443/LM4121AIM5-ADJ-NOPB-Texas-Instruments-datasheet-164415095.pdf?src-supplier=SHENGYU+ELECTRONICS; ComponentLink15Description: https://datasheet.octopart.com:443/LM4121AIM5-ADJ-NOPB-Texas-Instruments-datasheet-164415095.pdf?src-supplier=SHENGYU+ELECTRONICS; ComponentLink16URL: http://sigma.octopart.com:80/reach_statement/Texas-Instruments-company-64.pdf?src-supplier=Compliance+Statements; ComponentLink16Description: http://sigma.octopart.com:80/reach_statement/Texas-Instruments-company-64.pdf?src-supplier=Compliance+Statements; ComponentLink17URL: http://sigma.octopart.com:80/conflict_mineral_statement/Texas-Instruments-company-63.pdf?src-supplier=Compliance+Statements; ComponentLink17Description: http://sigma.octopart.com:80/conflict_mineral_statement/Texas-Instruments-company-63.pdf?src-supplier=Compliance+Statements